# Altium schematic sheet programmeShematics.SchDoc
size A4
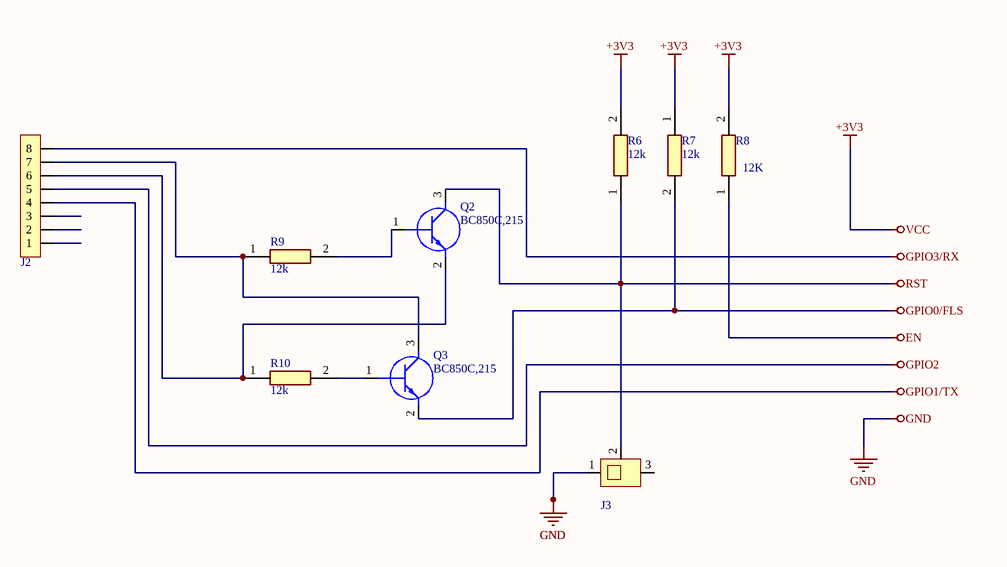
[diagram p0: programmeShematics.SchDoc]

## Parts
J2  Header Pins  [HEADER PIN 1x8]  (value not drawn)
J3  /ss-12d02-vg4  [Switch button]  (value not drawn)
Q2  BC850C,215  [SOT23]
Q3  BC850C,215  [SOT23]
R6  12k  [RESC2012X65N]
R7  12k  [RESC2012X65N]
R8  12K  [RESC2012X65N]
R9  12k  [RESC2012X65N]
R10  12k  [RESC2012X65N]

## Nets
+3V3: R6.2 R7.1 R8.2  [also labelled VCC]
EN: R8.1
GND: J3.1
GPIO0/FLS: Q3.2(E) R7.2
GPIO1/TX: J2.4
GPIO2: J2.5
GPIO3/RX: J2.8
RST: J3.2 Q2.3(C) R6.1
NetJ2_6: J2.6 Q2.2(E) R10.1
NetJ2_7: J2.7 Q3.3(C) R9.1
NetQ2_1: Q2.1(B) R9.2
NetQ3_1: Q3.1(B) R10.2

Not connected (* = marked no-connect by the designer): J2 1 2 3; J3 3

## Library data of the parts
J2 = Header Pins 1x8
J3 = Switch slide button
Q2 Q3 = BC850C,215: Transistor BJT NPN; Manufacturer_Name: Nexperia; Datasheet Link: https://assets.nexperia.com/documents/data-sheet/BC849_BC850.pdf; Height: 1.1mm; Manufacturer_Part_Number: BC850C,215; Mouser Part Number: 771-BC850C-T/R; Mouser Price/Stock: https://www.mouser.co.uk/ProductDetail/Nexperia/BC850C215?qs=me8TqzrmIYVR%2FGACbHj0Ow%3D%3D; Arrow Part Number: BC850C,215; Arrow Price/Stock: https://www.arrow.com/en/products/bc850c215/nexperia?region=europe
R6-R10 = CPF0805B102RE1: Resistor; Manufacturer_Name: TE Connectivity; Datasheet Link: http://docs-europe.electrocomponents.com/webdocs/13d1/0900766b813d116f.pdf; Height: 0.65mm; Manufacturer_Part_Number: CPF0805B102RE1